# EAGLE design sineGenerator (EAGLE 6.4)
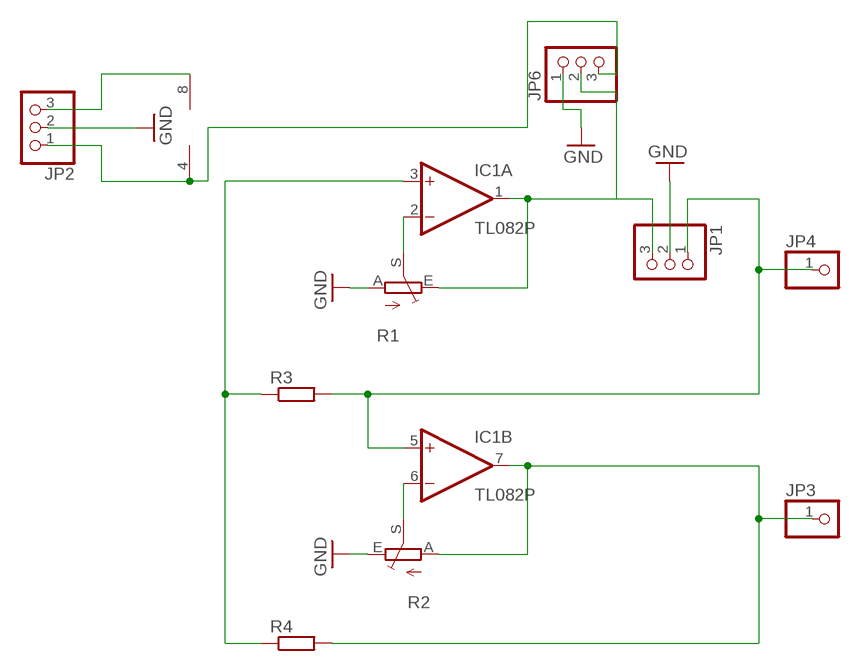
[diagram p0: schematic, sheet 1]

## Parts
IC1  TL082P  [DIL08]
JP1  PINHD-1X3  [1X03]
JP2  PINHD-1X3  [1X03]
JP3  PINHD-1X1  [1X01]
JP4  PINHD-1X1  [1X01]
JP6  PINHD-1X3  [1X03]
R1  TRIM_EU-CA9V  [CA9V]
R2  TRIM_EU-CA9V  [CA9V]
R3  R-EU_0204/2V  [0204V]
R4  R-EU_0204/2V  [0204V]

## Nets
GND: JP1.2 JP2.2 JP6.1 R1.A R2.E
N$1: IC1.8(P:V+) JP2.3
N$2: IC1.4(P:V-) JP2.1 JP6.3
N$3: IC1.1(A:OUT) JP1.3 JP6.2 R1.E
N$4: IC1.2(A:-IN) R1.S
N$5: IC1.3(A:+IN) R3.1 R4.1
N$6: IC1.6(B:-IN) R2.S
N$7: IC1.5(B:+IN) JP1.1 JP4.1 R3.2
N$8: IC1.7(B:OUT) JP3.1 R2.A R4.2

## Library data of the parts
IC1 = linear:TL082: OP AMP
JP1 JP2 JP6 = pinhead:PINHD-1X3: PIN HEADER
JP3 JP4 = pinhead:PINHD-1X1: PIN HEADER
R1 R2 = pot:TRIM_EU-: POTENTIOMETER
R3 R4 = rcl:R-EU_: RESISTOR, European symbol

## Board
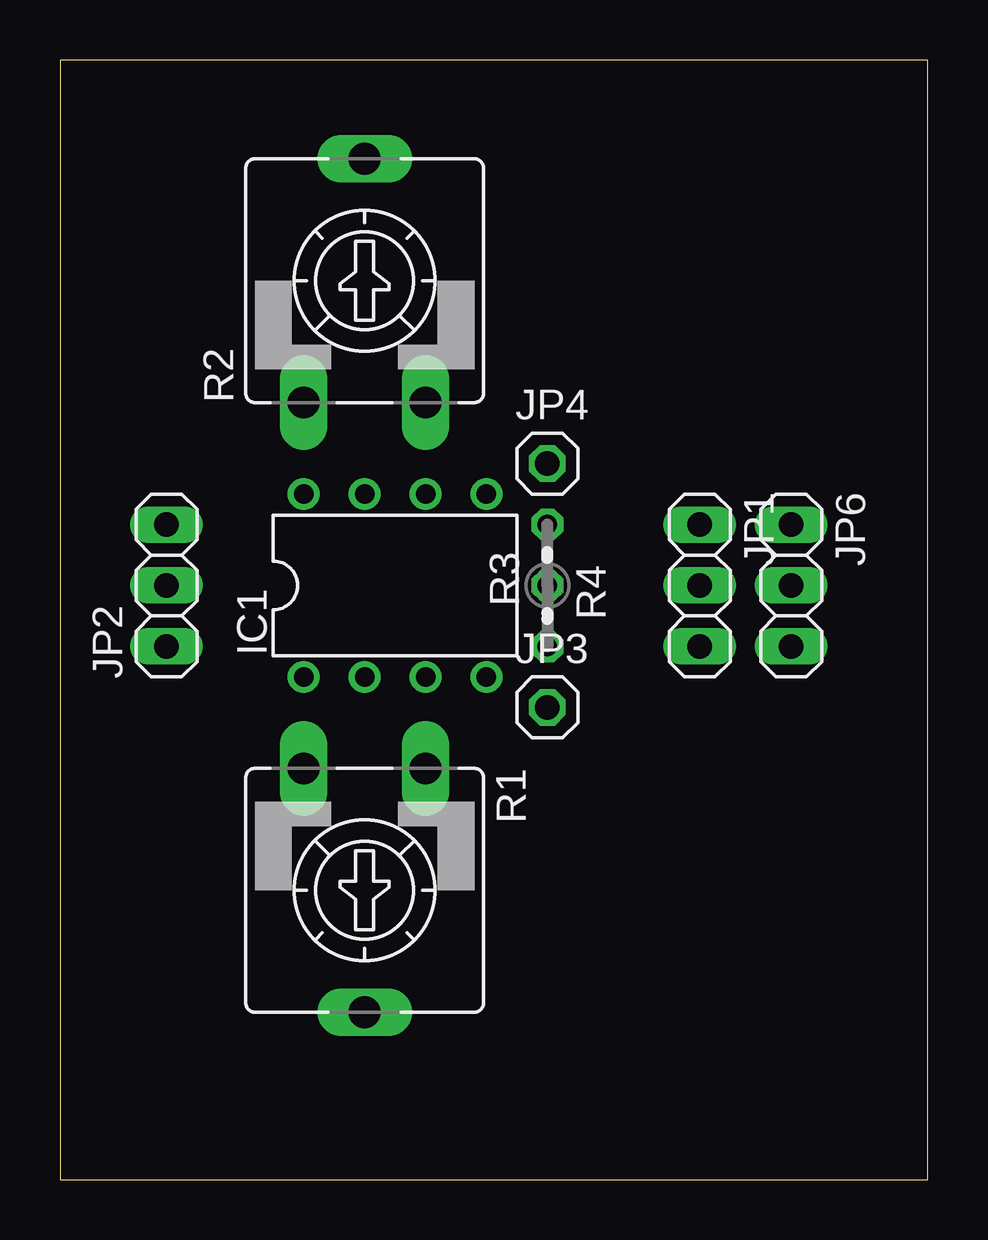
[diagram p1: board, top side]
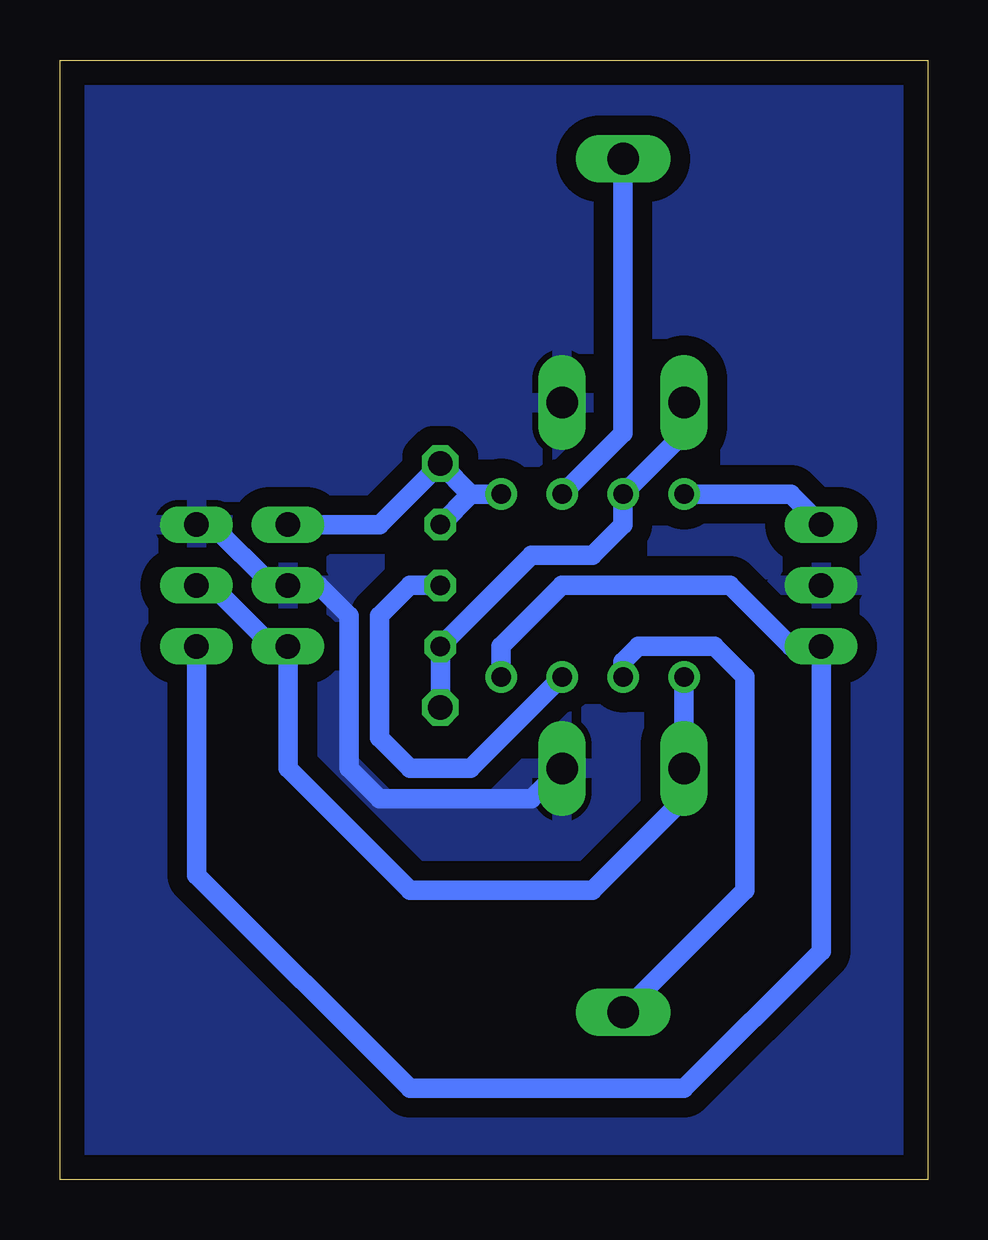
[diagram p2: board, bottom side, seen from below]

Size 36.17 x 46.66 mm. Coordinates in mm from the lower left corner, seen from the top.
Outline: 0,0 36.17,0 36.17,46.66 0,46.66 0,0
Copper layers (1*16): Top 0.035mm / dielectric 1.5mm / Bottom 0.035mm
Design rules "default": minimum track width 10mil, minimum drill 24mil, track to track 8mil, track to pad 8mil, pad to pad 8mil, via to via 8mil, smd to smd 8mil, copper to edge 40mil, drill to drill 8mil, minimum pad ring 10mil, minimum via ring 8mil, stop-mask expansion 4mil, vias tented up to drill 0mil, thermal gap 10mil

### Footprints (pad centres in the part's own frame; a part is rotated, then mirrored left to right if it is on the bottom)
DIL08 = drill 0.813 pad 1.27: 1 -3.81,-3.81; 2 -1.27,-3.81; 3 1.27,-3.81; 4 3.81,-3.81; 5 3.81,3.81; 6 1.27,3.81; 7 -1.27,3.81; 8 -3.81,3.81
1X03 = drill 1.016 long: 1 -2.54,0; 2 0,0; 3 2.54,0
1X01 = drill 1.016 octagon: 1 0,0
CA9V = drill 1.321 long: A -2.54,-5.08; E 2.54,-5.08; S 0,5.08
0204V = drill 0.813 octagon: 1 -1.27,0; 2 1.27,0

### Placement (x,y rotation side)
IC1  13.97,24.77 0 top
JP1  26.67,24.77 270 top
JP2  4.45,24.77 90 top
JP3  20.32,19.68 0 top
JP4  20.32,29.84 0 top
JP6  30.48,24.77 270 top
R1  12.7,12.06 180 top
R2  12.7,37.47 0 top
R3  20.32,26.04 90 top
R4  20.32,23.5 270 top

### Tracks (layer width: path | path; a pad name or v marks a point on that pad's centre or on a via)
GND
  Bottom 0.813: 25.4,24.77 24.13,23.5 24.13,17.14 22.86,15.88 16.51,15.88 R1.A | JP2.2 3.81,24.77 | JP1.2 27.3,24.77 29.84,27.3 JP6.1
  pour Bottom (isolate 0.813): 0,46.36 0,0 36.2,0 36.2,46.36
N$1
  Bottom 0.813: JP2.3 5.71,28.57 IC1.8
N$2
  Bottom 0.813: JP6.3 30.48,12.7 21.59,3.81 10.16,3.81 4.45,9.53 JP2.1 5.71,22.22 8.26,24.77 15.24,24.77 17.78,22.22 IC1.4
N$3
  Bottom 0.813: IC1.1 R1.E 10.16,15.88 13.97,12.06 21.59,12.06 26.67,17.14 JP1.3 27.3,22.22 29.84,24.77 JP6.2
N$4
  Bottom 0.813: IC1.2 12.7,21.59 12.06,22.22 8.89,22.22 7.62,20.95 7.62,12.06 R1.S
N$5
  Bottom 0.813: R4.1 21.59,24.77 22.86,23.5 22.86,18.41 21.59,17.14 19.05,17.14 IC1.3
N$6
  Bottom 0.813: R2.S 12.7,31.11 IC1.6
N$7
  Bottom 0.813: IC1.5 19.05,28.57 | 19.05,28.57 R3.2 | JP1.1 22.86,27.3 JP4.1 19.05,28.57
N$8
  Bottom 0.813: R2.A 10.16,31.11 IC1.7 12.7,27.3 13.97,26.04 16.51,26.04 R4.2 JP3.1